# Altium project HandChip.PrjPcb
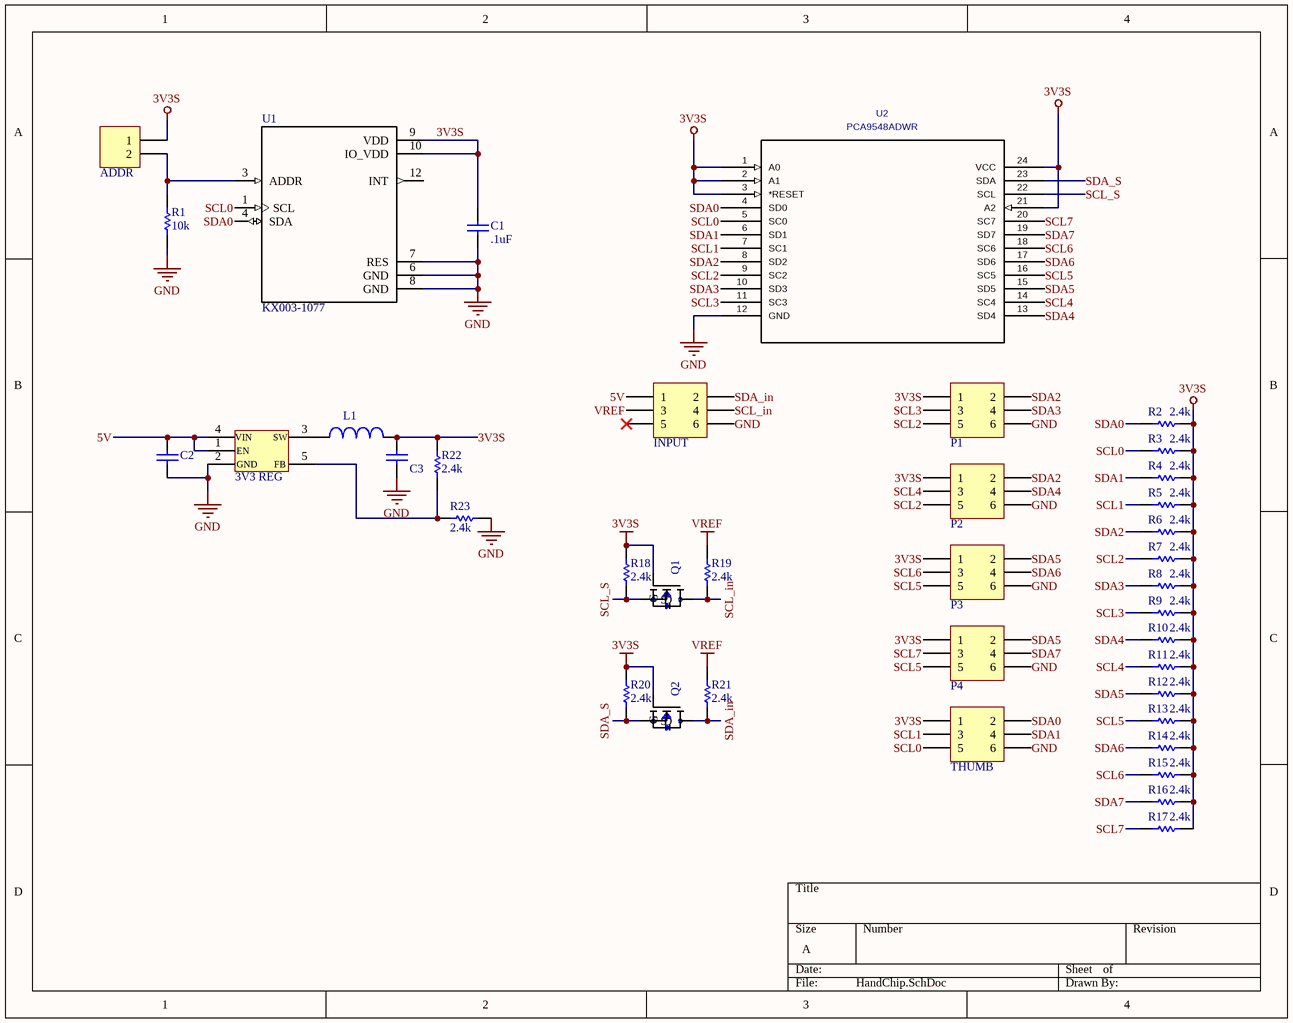
[diagram p0: HandChip.SchDoc]
1 sheet, 39 parts. Net scope: global (net labels, ports and power ports of the same name join across sheets).
Board file: HandChip.PcbDoc

## Sheet HandChip.SchDoc
size A

### Parts
3V3_REG  TLV62568DBVR  [*SOT95P280X145-5N]  (value not drawn)
ADDR  90120-0122  [HDR1X2]  (value not drawn)
C1  .1uF  [0805-CAP]
C2  Cap  [0805-CAP]  (value not drawn)
C3  Cap  [0805-CAP]  (value not drawn)
INPUT  90131-0123  [HDR2X3]  (value not drawn)
L1  SDR0403-2R2ML  [*SDR0403]  (value not drawn)
P1  90131-0123  [HDR2X3]  (value not drawn)
P2  90131-0123  [HDR2X3]  (value not drawn)
P3  90131-0123  [HDR2X3]  (value not drawn)
P4  90131-0123  [HDR2X3]  (value not drawn)
Q1  BSS138  [*BSS138_BSS138(Primary)]  (value not drawn)
Q2  BSS138  [*BSS138_BSS138(Primary)]  (value not drawn)
R1  10k  [0805-RES]
R2  2.4k  [0805-RES]
R3  2.4k  [0805-RES]
R4  2.4k  [0805-RES]
R5  2.4k  [0805-RES]
R6  2.4k  [0805-RES]
R7  2.4k  [0805-RES]
R8  2.4k  [0805-RES]
R9  2.4k  [0805-RES]
R10  2.4k  [0805-RES]
R11  2.4k  [0805-RES]
R12  2.4k  [0805-RES]
R13  2.4k  [0805-RES]
R14  2.4k  [0805-RES]
R15  2.4k  [0805-RES]
R16  2.4k  [0805-RES]
R17  2.4k  [0805-RES]
R18  2.4k  [0805-RES]
R19  2.4k  [0805-RES]
R20  2.4k  [0805-RES]
R21  2.4k  [0805-RES]
R22  2.4k  [0805-RES]
R23  2.4k  [0805-RES]
THUMB  90131-0123  [HDR2X3]  (value not drawn)
U1  KX003-1077  [*XDCR_KX003-1077]
U2  PCA9548ADWR  [DW24]

### Nets
3V3S: ADDR.1 C1.2 C3.2 L1.2 P1.1 P2.1 P3.1 P4.1 Q1.G Q2.G R2.1 R3.1 R4.1 R5.1 R6.1 R7.1 R8.1 R9.1 R10.1 R11.1 R12.1 R13.1 R14.1 R15.1 R16.1 R17.1 R18.1 R20.1 R22.1 THUMB.1 U1.9(VDD) U1.10(IO_VDD) U2.1(A0) U2.2(A1) U2.3(*RESET) U2.21(A2) U2.24(VCC)  [also labelled \]
GND: 3V3_REG.2 C1.1 C2.1 C3.1 INPUT.6 P1.6 P2.6 P3.6 P4.6 R1.1 R23.2 THUMB.6 U1.6(GND) U1.7(RES) U1.8(GND) U2.12(GND)
VREF: INPUT.3 R19.1 R21.1
5V: 3V3_REG.1 3V3_REG.4 C2.2 INPUT.1
SCL0: R3.2 THUMB.5 U1.1(SCL) U2.5(SC0)
SCL1: R5.2 THUMB.3 U2.7(SC1)
SCL2: P1.5 P2.5 R7.2 U2.9(SC2)
SCL3: P1.3 R9.2 U2.11(SC3)
SCL4: P2.3 R11.2 U2.14(SC4)
SCL5: P3.5 P4.5 R13.2 U2.16(SC5)
SCL6: P3.3 R15.2 U2.18(SC6)
SCL7: P4.3 R17.2 U2.20(SC7)
SCL_in: INPUT.4 Q1.D R19.2
SCL_S: Q1.S R18.2 U2.22(SCL)
SDA0: R2.2 THUMB.2 U1.4(SDA) U2.4(SD0)
SDA1: R4.2 THUMB.4 U2.6(SD1)
SDA2: P1.2 P2.2 R6.2 U2.8(SD2)
SDA3: P1.4 R8.2 U2.10(SD3)
SDA4: P2.4 R10.2 U2.13(SD4)
SDA5: P3.2 P4.2 R12.2 U2.15(SD5)
SDA6: P3.4 R14.2 U2.17(SD6)
SDA7: P4.4 R16.2 U2.19(SD7)
SDA_in: INPUT.2 Q2.D R21.2
SDA_S: Q2.S R20.2 U2.23(SDA)
Net3V3_REG_3: 3V3_REG.3 L1.1
Net3V3_REG_5: 3V3_REG.5 R22.2 R23.1
NetADDR_2: ADDR.2 R1.2 U1.3(ADDR)

Not connected (* = marked no-connect by the designer): INPUT 5*; U1 12(INT)

### Notes on the sheet
- (in symbol TLV62568DBVR) VIN; SW; EN; GND; FB

### Library data of the parts
ADDR = 90120-0122: MOLEX CONN HEADER 2POS .100" STR TIN; GFUPartNo: 90120-0122; Manufacturer 1: Molex; Manufacturer Part Number 1: 90120-0122; Part Type: THRU; Supplier 1: Digi-Key; Supplier Part Number 1: WM8072-ND
C1-C3 = Cap: Capacitor
INPUT P1-P4 THUMB = 90131-0123: MOLEX CONN HEADER 6POS 2ROW .100" STR TIN; GFUPartNo: 90131-0123; Manufacturer 1: Molex; Manufacturer Part Number 1: 90131-0123; Part Type: THRU; Supplier 1: Digi-Key; Supplier Part Number 1: WM8121-ND
L1 = SDR0403-2R2ML: 2.2µH Unshielded Wirewound Inductor 2.6A 47mOhm Max Nonstandard; MF: Bourns; Availability: Unavailable; Price: None; MP: SDR0403-2R2ML; Package: Nonstandard Bourns; Value: *; digikey_Link: https://www.digikey.com/product-detail/en/bourns-inc/SDR0403-2R2ML/SDR0403-2R2MLCT-ND/2127089
Q1 Q2 = BSS138: N-Channel 50V 220mA _Ta_ 360mW _Ta_ Surface Mount Die; MF: MICROSS/On Semiconductor; SnapEDA_Link: https://www.snapeda.com/parts/BSS138/MICROSS/On%20Semiconductor/view-part/215/?ref=snap; Price: None; Availability: Unavailable; MP: BSS138; Package: SOT-23 Fairchild Semiconductor; Value: *
R1-R23 = ResBasic: Resistor
U1 = KX003-1077: / Accelerometer X, Y, Z Axis Â±2g, 4g, 8g, 16g 3.5kHz _X,Y_, 1.8kHz _Z_ 12-LGA _2x2_ /; MF: Rohm Semiconductor; Digi-Key_Part_Number: KX003-1077CT-ND; Package: VFLGA-12 Rohm Semiconductor; SnapEDA_Link: https://www.snapeda.com/parts/KX003-1077/Rohm/view-part/3603894/?ref=snap; Digi-Key_Purchase_URL: https://www.digikey.com/product-detail/en/rohm-semiconductor/KX003-1077/KX003-1077CT-ND/9679234?utm_source=snapeda&utm_medium=aggregator&utm_campaign=symbol; MP: KX003-1077; Value: *
U2 = PCA9548ADWR: Manufacturer: Texas Instruments; C: Copyright (C) 2015 Accelerated Designs. All rights reserved; Built_By: EMA_UL_Team; Value: PCA9548ADWR; Vendor: Texas Instruments; Manufacturer_Part_Number: PCA9548ADWR